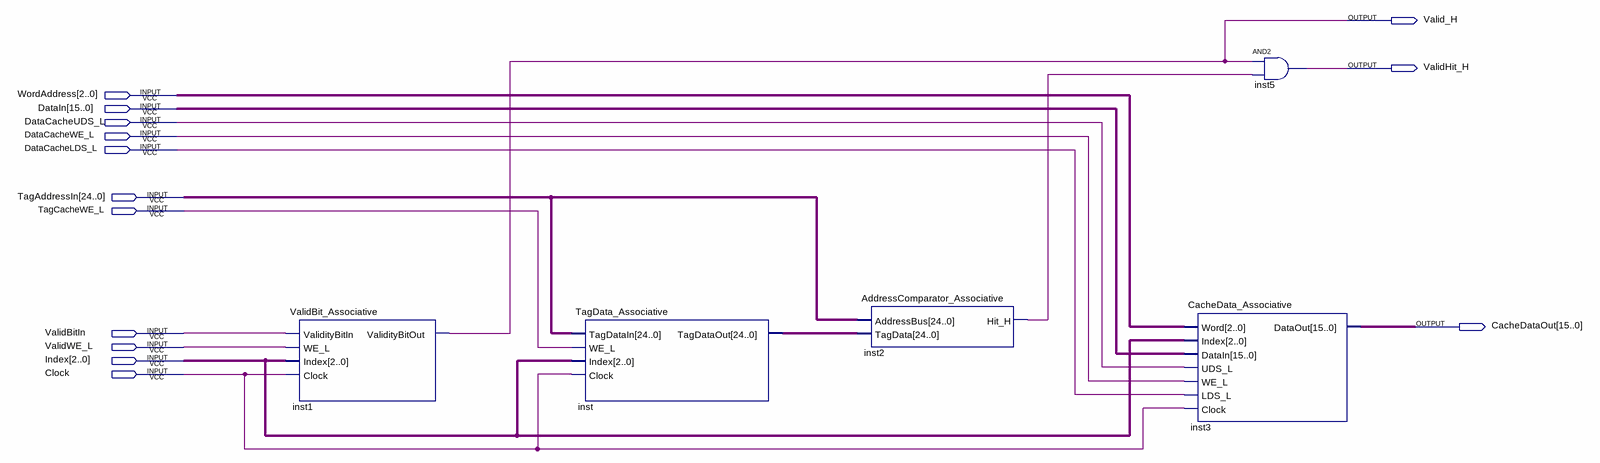
[diagram p0: schematic sheet]
// Quartus schematic AssociativeCache_Set.bdf as structural Verilog: 5 symbols, 14 pins
module AssociativeCache_Set (
  input  [2:0] WordAddress,
  input  [15:0] DataIn,
  input  DataCacheUDS_L,
  input  DataCacheWE_L,
  input  DataCacheLDS_L,
  input  [24:0] TagAddressIn,
  input  TagCacheWE_L,
  input  ValidBitIn,
  input  ValidWE_L,
  input  [2:0] Index,
  input  Clock,
  output Valid_H,
  output ValidHit_H,
  output [15:0] CacheDataOut
);

  wire inst2_hit_h;
  wire [24:0] inst_tagdataout;

  ValidBit_Associative inst1 (
    .ValidityBitIn(ValidBitIn), .WE_L(ValidWE_L), .Index(Index), .Clock(Clock), .ValidityBitOut(Valid_H));
  TagData_Associative inst (
    .TagDataIn(TagAddressIn), .WE_L(TagCacheWE_L), .Index(Index), .Clock(Clock), .TagDataOut(inst_tagdataout));
  AddressComparator_Associative inst2 (.AddressBus(TagAddressIn), .TagData(inst_tagdataout), .Hit_H(inst2_hit_h));
  CacheData_Associative inst3 (
    .Word(WordAddress), .Index(Index), .DataIn(DataIn), .UDS_L(DataCacheUDS_L), .WE_L(DataCacheWE_L),
    .LDS_L(DataCacheLDS_L), .Clock(Clock), .DataOut(CacheDataOut));
  and inst5 (ValidHit_H, Valid_H, inst2_hit_h);
endmodule
